# EAGLE design Smarttree_BMS_6 (EAGLE 7.7.0)

## Sheet 1 of 2
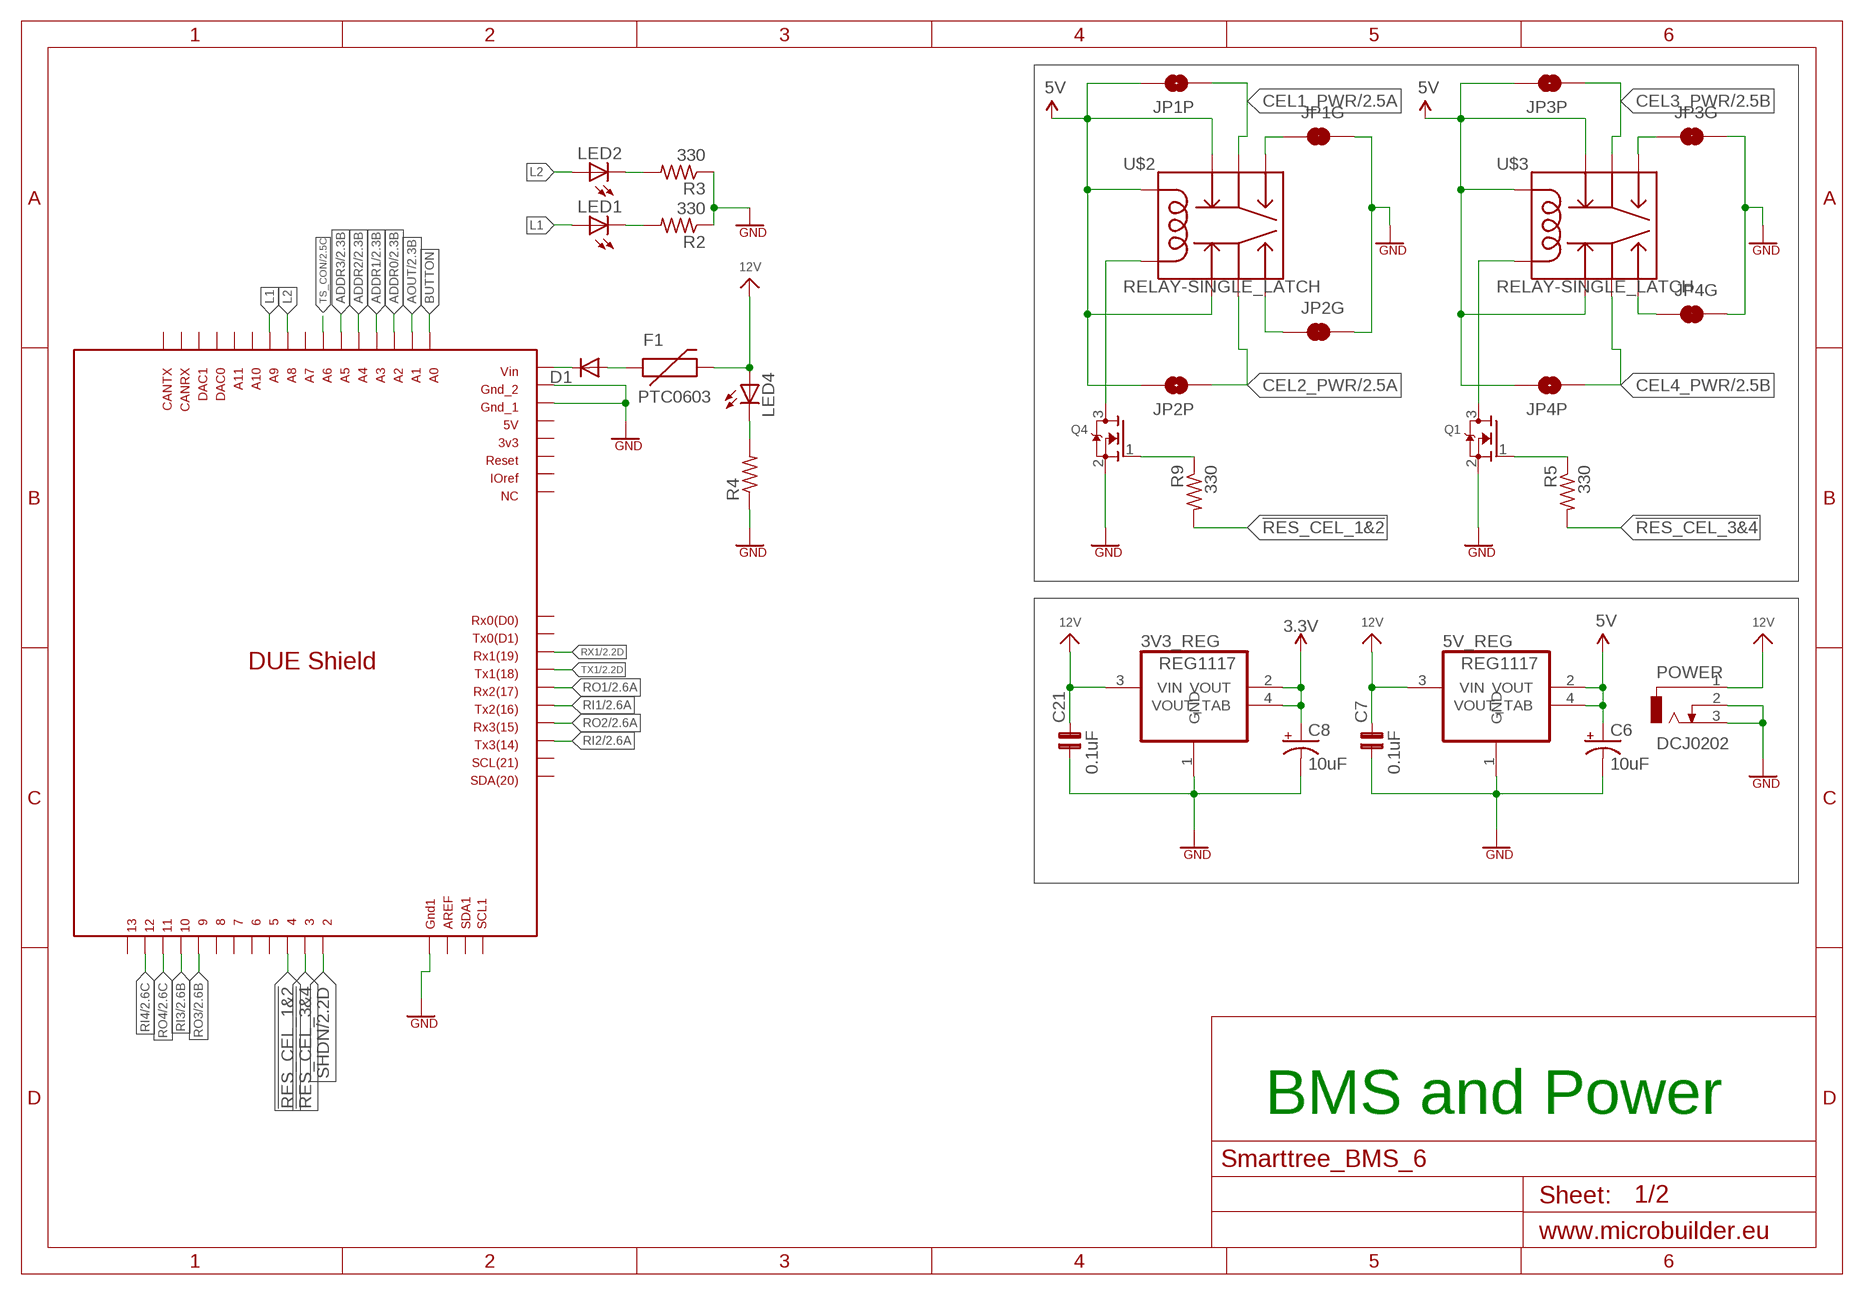
[diagram p0: schematic, sheet 1]

### Parts
3V3_REG  REG1117  [SOT223]
5V_REG  REG1117  [SOT223]
C6  10uF  10UF-TANT  [EIA3216]
C7  0.1uF  C-NP-SMD-0805  [C-0805]
C8  10uF  10UF-TANT  [EIA3216]
C21  0.1uF  C-NP-SMD-0805  [C-0805]
D1  DIODE-SOD106-R  [SOD106-R]
F1  PTC0603  [0603]
JP1G  JUMPER-SMT_2_NC_TRACE_SILK  [SMT-JUMPER_2_NC_TRACE_SILK]
JP1P  JUMPER-SMT_2_NO_SILK  [SMT-JUMPER_2_NO_SILK]
JP2G  JUMPER-SMT_2_NC_TRACE_SILK  [SMT-JUMPER_2_NC_TRACE_SILK]
JP2P  JUMPER-SMT_2_NO_SILK  [SMT-JUMPER_2_NO_SILK]
JP3G  JUMPER-SMT_2_NC_TRACE_SILK  [SMT-JUMPER_2_NC_TRACE_SILK]
JP3P  JUMPER-SMT_2_NO_SILK  [SMT-JUMPER_2_NO_SILK]
JP4G  JUMPER-SMT_2_NC_TRACE_SILK  [SMT-JUMPER_2_NC_TRACE_SILK]
JP4P  JUMPER-SMT_2_NO_SILK  [SMT-JUMPER_2_NO_SILK]
LED1  LED-YELLOW0603  [LED-0603]
LED2  LED-YELLOW0603  [LED-0603]
LED4  LED-YELLOW0603  [LED-0603]
POWER  DCJ0202  [DCJ0202]
Q1  MOSFET-NREFLOW  [SOT23]
Q4  MOSFET-NREFLOW  [SOT23]
R2  330  R-US_M0805  [M0805]
R3  330  R-US_M0805  [M0805]
R4  R-US_M0805  [M0805]
R5  330  R-US_R0805  [R0805]
R9  330  R-US_R0805  [R0805]
U$1  DUE(OUTLINE)  [DUE(NORMAL)]
U$2  RELAY-SINGLE_LATCH  [RELAY-EE2]
U$3  RELAY-SINGLE_LATCH  [RELAY-EE2]

### Nets
3.3V [power]: 3V3_REG.2(VOUT) 3V3_REG.4(VOUT_TAB) C8.A(+) ; also sheet 2
5V [power]: 5V_REG.2(VOUT) 5V_REG.4(VOUT_TAB) C6.A(+) JP1P.2 JP2P.2 JP3P.2 JP4P.2 U$2.P$1(COIL1) U$2.P$3 U$2.P$10 U$3.P$1(COIL1) U$3.P$3 U$3.P$10 ; also sheet 2
12V [power]: 3V3_REG.3(VIN) 5V_REG.3(VIN) C7.2 C21.2 F1.2 LED4.A POWER.1 ; also sheet 2
!RES_CEL_1&2: R9.2 U$1.4
!RES_CEL_3&4: R5.2 U$1.3
ADDR0: U$1.A2 ; also sheet 2
ADDR1: U$1.A3 ; also sheet 2
ADDR2: U$1.A4 ; also sheet 2
ADDR3: U$1.A5 ; also sheet 2
AOUT: U$1.A1 ; also sheet 2
BUTTON: U$1.A0
CEL1_PWR [power]: JP1P.1 U$2.P$4 ; also sheet 2
CEL2_PWR [power]: JP2P.1 U$2.P$9 ; also sheet 2
CEL3_PWR [power]: JP3P.1 U$3.P$4 ; also sheet 2
CEL4_PWR [power]: JP4P.1 U$3.P$9 ; also sheet 2
GND [power]: 3V3_REG.1(GND) 5V_REG.1(GND) C6.C(-) C7.1 C8.C(-) C21.1 JP1G.2 JP2G.2 JP3G.2 JP4G.2 POWER.2 POWER.3 Q1.2(S) Q4.2(S) R2.1 R3.1 R4.1 U$1.GND1 U$1.GND_1 U$1.GND_2 ; also sheet 2
L1: LED1.A U$1.A9
L2: LED2.A U$1.A8
N$1 [power]: JP1G.1 U$2.P$5
N$3: Q4.3(D) U$2.P$12(COIL12)
N$6: Q4.1(G) R9.1
N$7: Q1.1(G) R5.1
N$9: Q1.3(D) U$3.P$12(COIL12)
N$10 [power]: JP3G.1 U$3.P$5
N$11 [power]: JP4G.1 U$3.P$8
N$13 [power]: D1.C U$1.VIN
N$21 [power]: JP2G.1 U$2.P$8
N$57: LED1.C R2.2
N$58: LED2.C R3.2
N$59: LED4.C R4.2
N$69 [power]: D1.A F1.1
RI1: U$1.TX2 ; also sheet 2
RI2: U$1.TX3 ; also sheet 2
RI3: U$1.10 ; also sheet 2
RI4: U$1.12 ; also sheet 2
RO1: U$1.RX2 ; also sheet 2
RO2: U$1.RX3 ; also sheet 2
RO3: U$1.9 ; also sheet 2
RO4: U$1.11 ; also sheet 2
RX1: U$1.RX1 ; also sheet 2
SHDN: U$1.2 ; also sheet 2
TS_CON: U$1.A6 ; also sheet 2
TX1: U$1.TX1 ; also sheet 2
Unconnected: U$1.3V3 U$1.5 U$1.5V U$1.6 U$1.7 U$1.8 U$1.13 U$1.A7 U$1.A10 U$1.A11 U$1.AREF U$1.CANRX U$1.CANTX U$1.DAC0 U$1.DAC1 U$1.IOREF U$1.NC U$1.RESET U$1.RX0 U$1.SCL U$1.SCL1 U$1.SDA U$1.SDA1 U$1.TX0

### Notes on the sheet
- BMS and Power

## Sheet 2 of 2
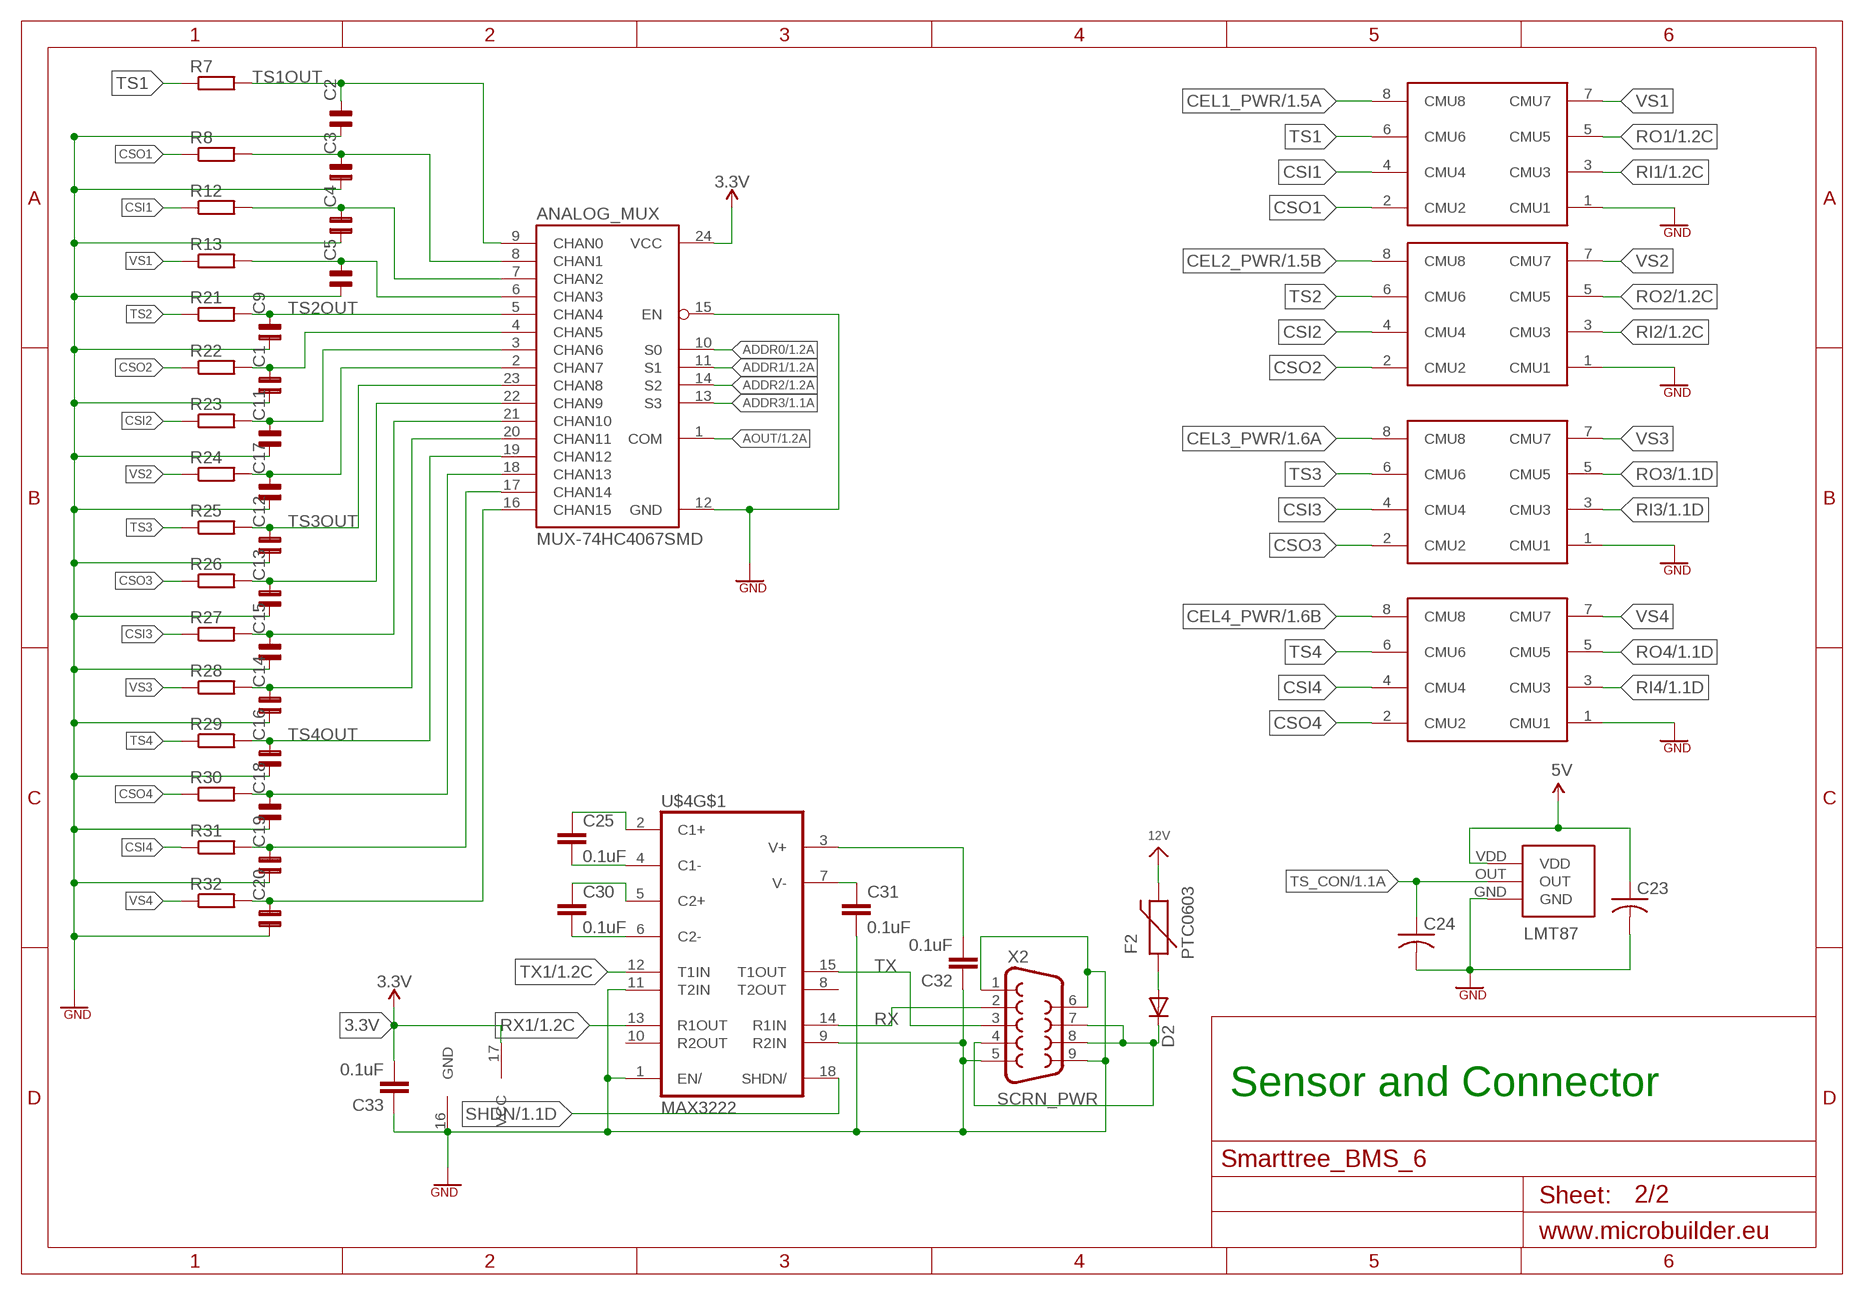
[diagram p1: schematic, sheet 2]

### Parts
ANALOG_MUX  MUX-74HC4067SMD  [SSOP24]
C1  C-NP-SMD-0805  [C-0805]
C2  C-NP-SMD-0805  [C-0805]
C3  C-NP-SMD-0805  [C-0805]
C4  C-NP-SMD-0805  [C-0805]
C5  C-NP-SMD-0805  [C-0805]
C9  C-NP-SMD-0805  [C-0805]
C11  C-NP-SMD-0805  [C-0805]
C12  C-NP-SMD-0805  [C-0805]
C13  C-NP-SMD-0805  [C-0805]
C14  C-NP-SMD-0805  [C-0805]
C15  C-NP-SMD-0805  [C-0805]
C16  C-NP-SMD-0805  [C-0805]
C17  C-NP-SMD-0805  [C-0805]
C18  C-NP-SMD-0805  [C-0805]
C19  C-NP-SMD-0805  [C-0805]
C20  C-NP-SMD-0805  [C-0805]
C23  C-USC0805  [C0805]
C24  C-USC0805  [C0805]
C25  0.1uF  CAP0603-CAP  [0603-CAP]
C30  0.1uF  CAP0603-CAP  [0603-CAP]
C31  0.1uF  CAP0603-CAP  [0603-CAP]
C32  0.1uF  CAP0603-CAP  [0603-CAP]
C33  0.1uF  CAP0603-CAP  [0603-CAP]
CEL1  8PINCONN  [8PINCONN]
CEL2  8PINCONN  [8PINCONN]
CEL3  8PINCONN  [8PINCONN]
CEL4  8PINCONN  [8PINCONN]
D2  DIODE-SOD106-R  [SOD106-R]
F2  PTC0603  [0603]
LMT87  LMT87_PAC  [LMT87_TO]
R7  R-EU_R0805W  [R0805W]
R8  R-EU_R0805W  [R0805W]
R12  R-EU_R0805W  [R0805W]
R13  R-EU_R0805W  [R0805W]
R21  R-EU_R0805W  [R0805W]
R22  R-EU_R0805W  [R0805W]
R23  R-EU_R0805W  [R0805W]
R24  R-EU_R0805W  [R0805W]
R25  R-EU_R0805W  [R0805W]
R26  R-EU_R0805W  [R0805W]
R27  R-EU_R0805W  [R0805W]
R28  R-EU_R0805W  [R0805W]
R29  R-EU_R0805W  [R0805W]
R30  R-EU_R0805W  [R0805W]
R31  R-EU_R0805W  [R0805W]
R32  R-EU_R0805W  [R0805W]
U$4  MAX3222  [SO18]
X2  DB9MALE  [DB9_MALE]

### Nets
3.3V [power]: ANALOG_MUX.24(VCC) C33.2 U$4.17(VCC) ; also sheet 1
5V [power]: C23.1 LMT87.VDD ; also sheet 1
12V [power]: F2.2 ; also sheet 1
ADDR0: ANALOG_MUX.10(S0) ; also sheet 1
ADDR1: ANALOG_MUX.11(S1) ; also sheet 1
ADDR2: ANALOG_MUX.14(S2) ; also sheet 1
ADDR3: ANALOG_MUX.13(S3) ; also sheet 1
AOUT: ANALOG_MUX.1(COM) ; also sheet 1
CEL1_PWR [power]: CEL1.8(CMU8) ; also sheet 1
CEL2_PWR [power]: CEL2.8(CMU8) ; also sheet 1
CEL3_PWR [power]: CEL3.8(CMU8) ; also sheet 1
CEL4_PWR [power]: CEL4.8(CMU8) ; also sheet 1
CSI1: CEL1.4(CMU4) R12.1
CSI2: CEL2.4(CMU4) R23.1
CSI3: CEL3.4(CMU4) R27.1
CSI4: CEL4.4(CMU4) R31.1
CSO1: CEL1.2(CMU2) R8.1
CSO2: CEL2.2(CMU2) R22.1
CSO3: CEL3.2(CMU2) R26.1
CSO4: CEL4.2(CMU2) R30.1
GND [power]: ANALOG_MUX.12(GND) ANALOG_MUX.15(EN) C1.1 C2.1 C3.1 C4.1 C5.1 C9.1 C11.1 C12.1 C13.1 C14.1 C15.1 C16.1 C17.1 C18.1 C19.1 C20.1 C23.2 C24.2 C31.2 C32.1 C33.1 CEL1.1(CMU1) CEL2.1(CMU1) CEL3.1(CMU1) CEL4.1(CMU1) LMT87.GND U$4.1(EN/) U$4.9(R2IN) U$4.11(T2IN) U$4.16(GND) X2.1 X2.5 X2.6 X2.9 ; also sheet 1
N$2: C31.1 U$4.7(V-)
N$5 [power]: D2.A F2.1
N$8: C25.1 U$4.2(C1+)
N$14: C25.2 U$4.4(C1-)
N$15: C30.1 U$4.5(C2+)
N$16: C30.2 U$4.6(C2-)
N$17: ANALOG_MUX.6(CHAN3) C5.2 R13.2
N$18: C32.2 U$4.3(V+)
N$19: ANALOG_MUX.8(CHAN1) C3.2 R8.2
N$20: ANALOG_MUX.7(CHAN2) C4.2 R12.2
N$26: ANALOG_MUX.4(CHAN5) C1.2 R22.2
N$28: ANALOG_MUX.3(CHAN6) C11.2 R23.2
N$30: ANALOG_MUX.2(CHAN7) C17.2 R24.2
N$34: ANALOG_MUX.22(CHAN9) C13.2 R26.2
N$36: ANALOG_MUX.21(CHAN10) C15.2 R27.2
N$38: ANALOG_MUX.20(CHAN11) C14.2 R28.2
N$42: ANALOG_MUX.18(CHAN13) C18.2 R30.2
N$43: ANALOG_MUX.17(CHAN14) C19.2 R31.2
N$46: ANALOG_MUX.16(CHAN15) C20.2 R32.2
RI1: CEL1.3(CMU3) ; also sheet 1
RI2: CEL2.3(CMU3) ; also sheet 1
RI3: CEL3.3(CMU3) ; also sheet 1
RI4: CEL4.3(CMU3) ; also sheet 1
RO1: CEL1.5(CMU5) ; also sheet 1
RO2: CEL2.5(CMU5) ; also sheet 1
RO3: CEL3.5(CMU5) ; also sheet 1
RO4: CEL4.5(CMU5) ; also sheet 1
RX [power]: U$4.14(R1IN) X2.2
RX1: U$4.13(R1OUT) ; also sheet 1
SCRN_PWR [power]: D2.C X2.4 X2.7 X2.8
SHDN: U$4.18(SHDN/) ; also sheet 1
TS1: CEL1.6(CMU6) R7.1
TS1OUT: ANALOG_MUX.9(CHAN0) C2.2 R7.2
TS2: CEL2.6(CMU6) R21.1
TS2OUT: ANALOG_MUX.5(CHAN4) C9.2 R21.2
TS3: CEL3.6(CMU6) R25.1
TS3OUT: ANALOG_MUX.23(CHAN8) C12.2 R25.2
TS4: CEL4.6(CMU6) R29.1
TS4OUT: ANALOG_MUX.19(CHAN12) C16.2 R29.2
TS_CON: C24.1 LMT87.OUT ; also sheet 1
TX: U$4.15(T1OUT) X2.3
TX1: U$4.12(T1IN) ; also sheet 1
VS1: CEL1.7(CMU7) R13.1
VS2: CEL2.7(CMU7) R24.1
VS3: CEL3.7(CMU7) R28.1
VS4: CEL4.7(CMU7) R32.1
Unconnected: U$4.8(T2OUT) U$4.10(R2OUT)

### Notes on the sheet
- Sensor and Connector

## Library data of the parts
3V3_REG 5V_REG = burr-brown:REG1117: 800mA and 1A Low Dropout (LDO) Positive Regulator 1.8V, 2.5V, 2.85V, 3.3V, 5V, and Adj; MPN: REG1117; OC_FARNELL: 1097566; OC_NEWARK: 14P6981
ANALOG_MUX = SparkFun-AnalogIC:MUX-74HC4067: 16-channel analog MUX; OC_NEWARK: unknown
C1-C5 C7 C9 C11-C21 = cap-pan40:C-NP: NON-POLARIZED FILM/CHIP; OC_NEWARK: unknown
C6 C8 = SparkFun-Retired:10UF-TANT: 10uF Tantalum SMT CAP-00811- 16V 10% (EIA-3216); OC_NEWARK: unknown; PROD_ID: CAP-00811
C23 C24 = adafruit:C-US: CAPACITOR, American symbol
C25 C30-C33 = SparkFun:CAP: Capacitor Standard 0603 ceramic capacitor, and 0.1" leaded capacitor.
CEL1-CEL4 = SmartTreeCan:8PINCONN
D1 D2 = diode:DIODE-: DIODE; OC_NEWARK: unknown
F1 F2 = SparkFun:PTC: Resettable Fuse PTC Resettable Fuse. Spark Fun Electronics SKU : COM-08357
JP1G JP2G JP3G JP4G = SparkFun-Jumpers:JUMPER-SMT_2_NC_TRACE: Normally closed trace jumper This jumper has a trace between two pads so it's normally closed (NC). Use a razor knife to open the connection. For best results follow the IPC guidelines for cutting traces: Cutout at least 0.063 mm (0.005 in). Remove all loose material to clean up the cut area. Seal the cut with an approved epoxy. Reapply solder to reclose the connection.
JP1P JP2P JP3P JP4P = SparkFun-Jumpers:JUMPER-SMT_2_NO: Normally open jumper This jumper has two pads in close proximity to each other. Apply solder to close the connection. Round pads are easier to solder for beginners, but are a lot larger. SparkFun Product that uses the round pads: SparkFun EL Sequencer <https://www.sparkfun.com/products/12781>
LED1 LED2 LED4 = SparkFun-LED:LED-YELLOW: Yellow SMD LEDs LilyPad 1206- DIO-09909 0603- DIO-09003; PROD_ID: DIO-09003
LMT87 = nick:LMT87_PAC
POWER = con-jack:DCJ0202: DC POWER JACK Source: DCJ0202.pdf; OC_FARNELL: unknown; OC_NEWARK: unknown
Q1 Q4 = adafruit:MOSFET-N: N-Channel Mosfet 2N7002E - 60V 260mA SOT23 [Digikey: 2N7002ET1GOSTR-ND] - REEL BSH103 - 30V 850mA SOT23 [Digikey: 568-5013-1-ND]
R2-R4 = adafruit:R-US_: RESISTOR, American symbol; OC_NEWARK: unknown
R5 R9 = adafruit:R-US_: RESISTOR, American symbol
R7 R8 R12 R13 R21-R32 = resistor:R-EU_: RESISTOR, European symbol; OC_NEWARK: unknown
U$1 = DUElib130425:DUE(OUTLINE)
U$2 U$3 = SmartTreeCan:RELAY-SINGLE_LATCH
U$4 = Francis-Project:MAX3222
X2 = SparkFun-Connectors:DB9: DB9 Connector Standard DB9 (D-Sub 9) serial connector. Can be used for CAN bus as well as RS485 and RS232. Footprint production proven. Spark Fun Electronics SKU : PRT-00429; PROD_ID: CONN-09904

## Net classes
0 default: width 0.203 mm
1 power: width 0.33 mm, clearance 0.152 mm

## Board
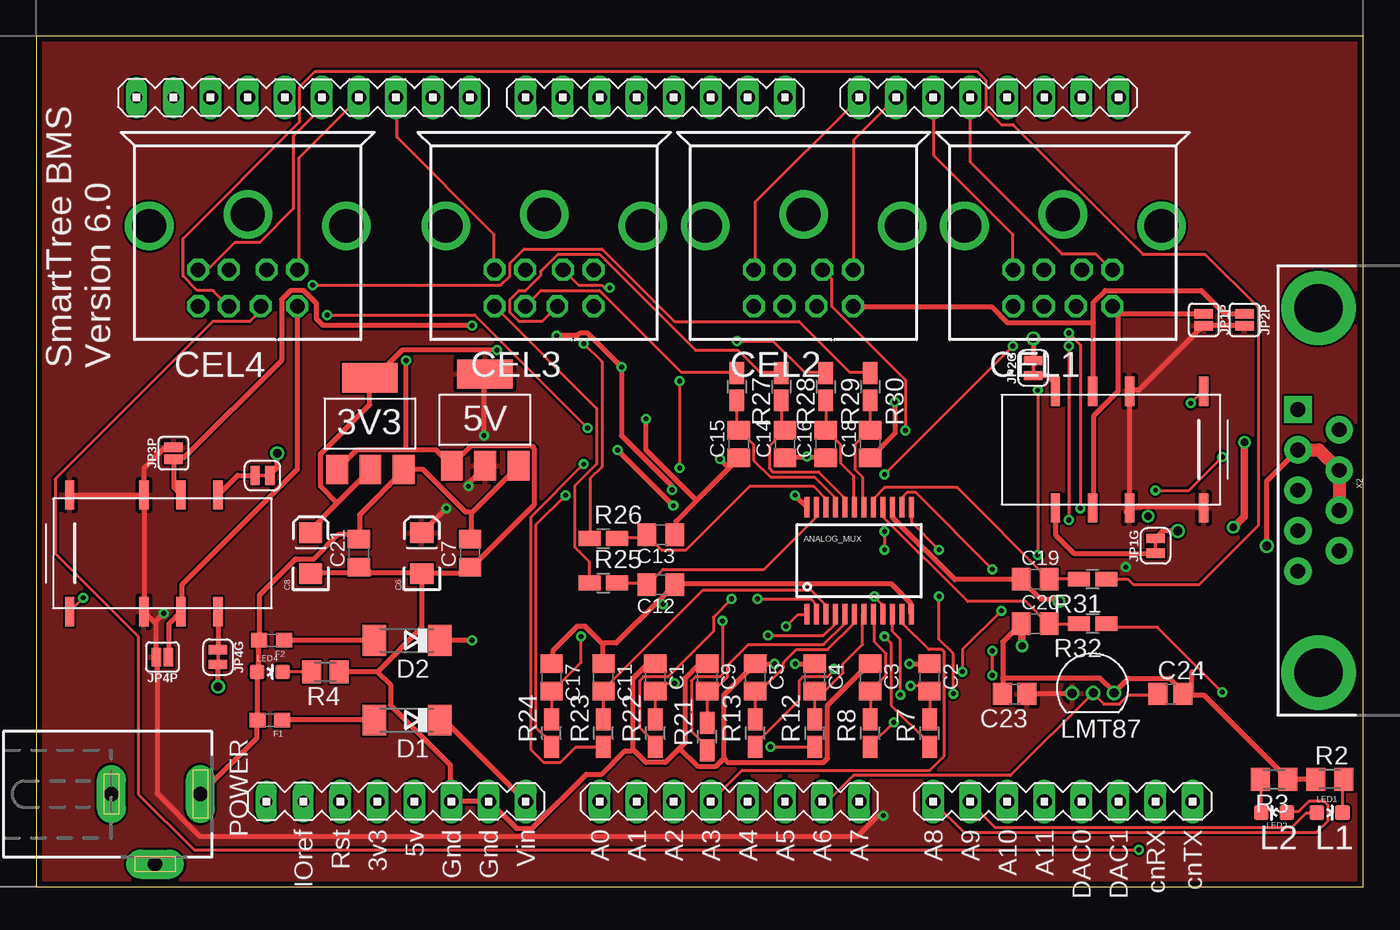
[diagram p2: board, top side]
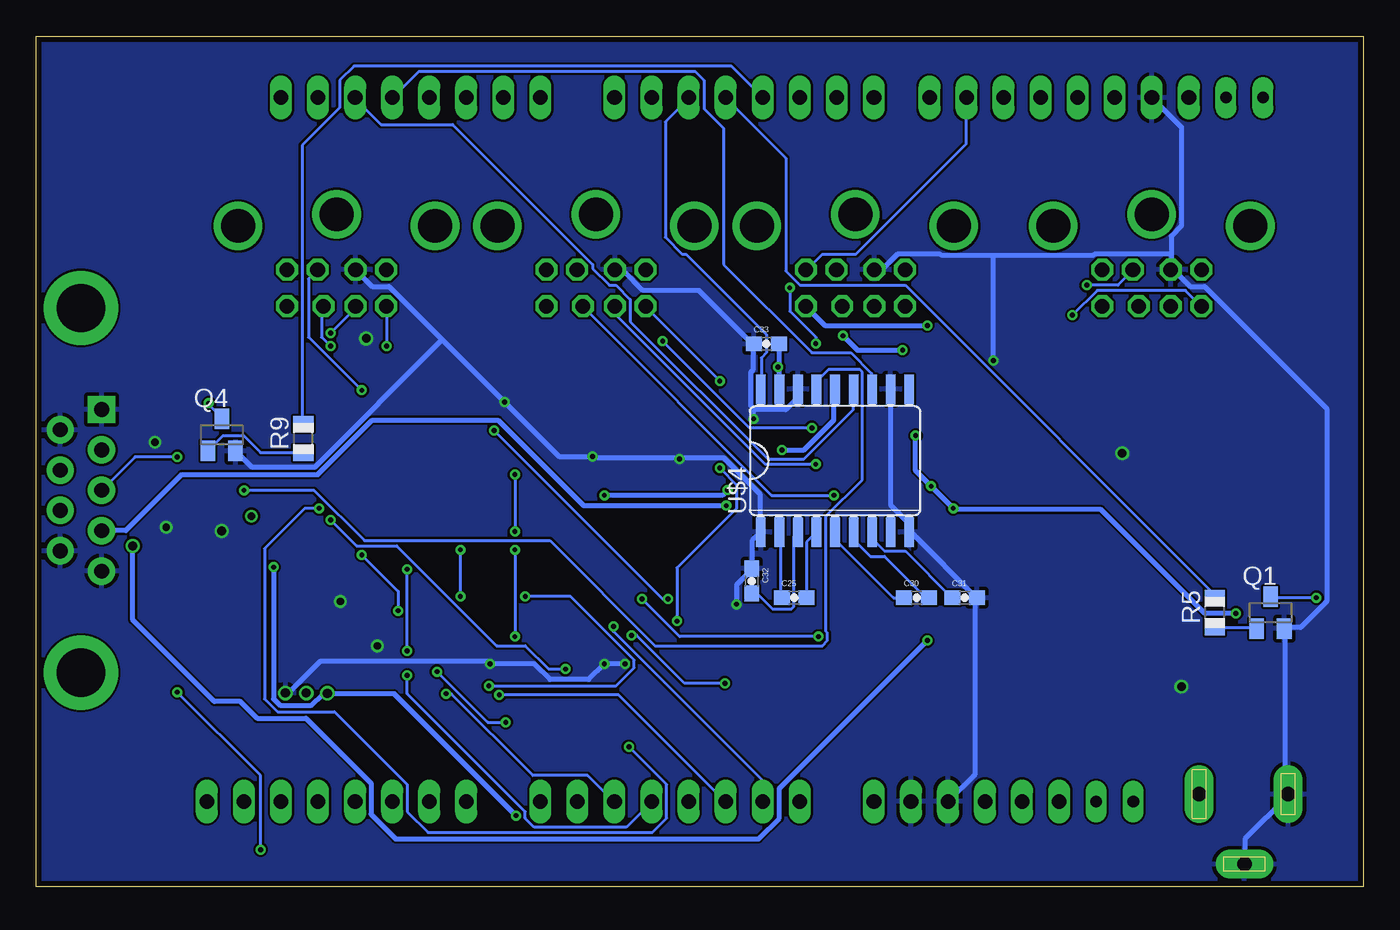
[diagram p3: board, bottom side, seen from below]

Size 90.93 x 58.29 mm. Coordinates in mm from the lower left corner, seen from the top.
Outline: 0,0 90.93,0 90.93,58.29 0,58.29 0,0
Copper layers (1*16): Top 0.0356mm / dielectric 1.5011mm / Bottom 0.0356mm
Design rules "LaenPCBOrder *": minimum track width 6mil, minimum drill 13mil, track to track 6mil, track to pad 6mil, pad to pad 6mil, via to via 6mil, smd to smd 6mil, copper to edge 15mil, drill to drill 8mil, minimum pad ring 7mil, minimum via ring 7mil, stop-mask expansion 3mil, vias tented up to drill 0mil, thermal gap 10mil

### Footprints (pad centres in the part's own frame; a part is rotated, then mirrored left to right if it is on the bottom)
SOT223 = smd 1.499 x 2.007: 1 -2.261,-3.15; 2 0.025,-3.15; 3 2.311,-3.15 | smd 3.81 x 2.007: 4 0,3.15
SSOP24 = smd 0.348 x 1.397: 1 -3.575,-3.656; 2 -2.925,-3.656; 3 -2.275,-3.656; 4 -1.625,-3.656; 5 -0.975,-3.656; 6 -0.325,-3.656; 7 0.325,-3.656; 8 0.975,-3.656; 9 1.625,-3.656; 10 2.275,-3.656; 11 2.925,-3.656; 12 3.575,-3.656; 13 3.575,3.656; 14 2.925,3.656; 15 2.275,3.656; 16 1.625,3.656; 17 0.975,3.656; 18 0.325,3.656; 19 -0.325,3.656; 20 -0.975,3.656; 21 -1.625,3.656; 22 -2.275,3.656; 23 -2.925,3.656; 24 -3.575,3.656
C-0805 = smd 1.27 x 1.524: 1 -0.953,0; 2 0.953,0
EIA3216 = smd 1.4 x 1.6: A 1.4,0; C -1.4,0
C0805 = smd 1.3 x 1.5: 1 -0.85,0; 2 0.85,0
0603-CAP = smd 1.1 x 1: 1 -0.85,0; 2 0.85,0
8PINCONN = drill 1 octagon: 1 -1.3,-8.5; 2 1.3,-8.5; 3 -3.4,-8.5; 4 -1.3,-11; 5 3.4,-8.5; 6 -3.4,-11; 7 0.9,-11; 8 3.4,-11 | drill 2.31: P$1 -6.75,-5.5; P$2 6.75,-5.5; P$3 0,-4.7
SOD106-R = smd 1.6 x 2.1: A 2.25,0; C -2.25,0
0603 = smd 1.1 x 1: 1 -0.85,0; 2 0.85,0
SMT-JUMPER_2_NC_TRACE_SILK = smd 0.635 x 1.27: 1 -0.508,0; 2 0.508,0
SMT-JUMPER_2_NO_SILK = smd 0.635 x 1.27: 1 -0.406,0; 2 0.406,0
LED-0603 = smd 1 x 1: A 0,-0.877; C 0,0.877
LMT87_TO = drill 0.635: GND 0.305,-1.346; OUT 1.727,-1.346; VDD 3.175,-1.321
DCJ0202 = drill 1 pad 2 long: 1 0,3.1; 2 4.8,0; 3 0,-3
SOT23 = smd 1 x 1.4: 1 -0.95,-1.1; 2 0.95,-1.1; 3 0,1.1
M0805 = smd 1.3 x 1.6: 1 -0.95,0; 2 0.95,0
R0805 = smd 1.1 x 1.4: 1 -1,0; 2 1,0
R0805W = smd 1.5 x 1: 1 -0.94,0; 2 0.94,0
DUE(NORMAL) = drill 1 long: 2 -16.51,30.48; 3 -19.05,30.48; 3V3 -39.37,-17.78; 4 -21.59,30.48; 5 -24.13,30.48; 5V -36.83,-17.78; 6 -26.67,30.48; 7 -29.21,30.48; 8 -33.02,30.48; 9 -35.56,30.48; 10 -38.1,30.48; 11 -40.64,30.48; 12 -43.18,30.48; 13 -45.72,30.48; A0 -24.13,-17.78; A1 -21.59,-17.78; A2 -19.05,-17.78; A3 -16.51,-17.78; A4 -13.97,-17.78; A5 -11.43,-17.78; A6 -8.89,-17.78; A7 -6.35,-17.78; A8 -1.27,-17.78; A9 1.27,-17.78; A10 3.81,-17.78; A11 6.35,-17.78; AREF -50.8,30.48; AREF1 -50.8,30.48; CANRX 13.97,-17.78; CANTX 16.51,-17.78; DAC0 8.89,-17.78; DAC1 11.43,-17.78; GND1 -48.26,30.48; GND_1 -34.29,-17.78; GND_2 -31.75,-17.78; RESET -41.91,-17.78; RX0 -11.43,30.48; RX1 6.35,30.48; RX2 1.27,30.48; RX3 -3.81,30.48; SCL 11.43,30.48; SDA 8.89,30.48; TX0 -13.97,30.48; TX1 3.81,30.48; TX2 -1.27,30.48; TX3 -6.35,30.48; VIN -29.21,-17.78 | drill 0.8 pad 1.422 long: IOREF -44.45,-17.78; NC -46.99,-17.78; SCL1 -55.88,30.48; SDA1 -53.34,30.48
RELAY-EE2 = smd 0.635 x 2: P$1 -6.35,4; P$3 -1.27,4; P$4 1.27,4; P$5 3.81,4; P$8 3.81,-4; P$9 1.27,-4; P$10 -1.27,-4; P$12 -6.35,-4
SO18 = smd 0.66 x 2.032: 1 -5.08,-4.902; 2 -3.81,-4.902; 3 -2.54,-4.902; 4 -1.27,-4.902; 5 0,-4.902; 6 1.27,-4.902; 7 2.54,-4.902; 8 3.81,-4.902; 9 5.08,-4.902; 10 5.08,4.902; 11 3.81,4.902; 12 2.54,4.902; 13 1.27,4.902; 14 0,4.902; 15 -1.27,4.902; 16 -2.54,4.902; 17 -3.81,4.902; 18 -5.08,4.902
DB9_MALE = drill 1.016 pad 1.88: 1 5.54,-1.42; 2 2.77,-1.42; 3 0,-1.42; 4 -2.77,-1.42; 6 4.15,1.42; 7 1.38,1.42; 8 -1.38,1.42; 9 -4.15,1.42 | drill 1.016 pad 1.88 square: 5 -5.54,-1.42 | drill 3.302 pad 5.08: G1 -12.5,0; G2 12.5,0

### Placement (x,y rotation side)
3V3_REG  22.86,31.75 0 top
5V_REG  30.73,32 0 top
ANALOG_MUX  56.39,22.35 0 top
C1  42.42,14.35 270 top
C2  61.21,14.35 270 top
C3  57.15,14.35 270 top
C4  53.34,14.35 270 top
C5  49.28,14.35 270 top
C6  26.42,22.86 90 top
C7  29.72,22.86 90 top
C8  18.8,22.86 90 top
C9  45.97,14.35 270 top
C11  38.86,14.35 270 top
C12  42.8,20.7 180 top
C13  42.8,24.13 180 top
C14  51.31,30.35 90 top
C15  48.13,30.35 90 top
C16  54.1,30.35 90 top
C17  35.31,14.35 270 top
C18  57.15,30.35 90 top
C19  68.45,21.08 0 top
C20  68.45,18.03 0 top
C21  22.1,22.86 90 top
C23  67.06,13.21 180 top
C24  77.72,13.21 0 top
C25  38.99,19.81 0 bottom
C30  30.61,19.81 0 bottom
C31  27.3,19.81 0 bottom
C32  41.91,20.95 270 bottom
C33  40.89,37.21 0 bottom
CEL1  70.36,50.8 0 top
CEL2  52.58,50.8 0 top
CEL3  34.8,50.8 0 top
CEL4  14.48,50.8 0 top
D1  25.4,11.43 180 top
D2  25.4,16.89 180 top
F1  16,11.43 180 top
F2  16.13,16.89 180 top
JP1G  76.71,23.37 90 top
JP1P  80.01,38.86 270 top
JP2G  68.33,35.56 90 top
JP2P  82.8,38.86 270 top
JP3G  15.49,28.19 0 top
JP3P  9.4,29.72 90 top
JP4G  12.45,15.75 270 top
JP4P  8.64,15.75 180 top
LED1  88.65,5.08 270 top
LED2  84.84,5.08 90 top
LED4  16,14.73 270 top
LMT87  74.17,11.94 180 top
POWER  8.13,6.35 270 top
Q1  6.35,18.8 0 bottom
Q4  78.23,30.99 0 bottom
R2  88.65,7.37 0 top
R3  84.84,7.37 180 top
R4  19.81,14.73 180 top
R5  10.16,18.8 90 bottom
R7  61.21,10.54 90 top
R8  57.15,10.54 90 top
R9  72.64,30.73 90 bottom
R12  53.34,10.54 90 top
R13  49.28,10.54 90 top
R21  45.97,10.29 90 top
R22  42.42,10.54 90 top
R23  38.86,10.54 90 top
R24  35.31,10.54 90 top
R25  38.86,20.83 0 top
R26  38.86,23.88 0 top
R27  48.01,34.29 270 top
R28  51.05,34.29 270 top
R29  54.1,34.29 270 top
R30  57.15,34.29 270 top
R31  72.39,21.08 180 top
R32  72.39,18.03 180 top
U$1  62.74,23.62 0 top
U$2  73.66,29.97 180 top
U$3  8.64,22.86 0 top
U$4  36.2,29.21 0 bottom
X2  87.88,27.18 270 top

### Tracks (layer width: path | path; a pad name or v marks a point on that pad's centre or on a via)
3.3V  (via drill 0.33)
  Top 0.33: 20.62,26.3 22.85,28.52 3V3_REG.2 | 20.62,26.3 18.85,24.52 18.85,24.35 C8.A | 20.62,26.3 19.47,27.46 19.47,29.68 22.85,33.06 22.85,34.84 3V3_REG.4 23.02,34.93 23.2,34.93 25.07,36.79 v31.56,36.79 | v52.01,26.84 52.81,26.03 ANALOG_MUX.24 | v43.56,27.19 43.56,27.46 40.09,30.93 v40.09,35.64 37.78,37.95 37.25,37.95 37.07,37.77 v35.65,37.77
  Bottom 0.33: U$4.17 40.01,35.64 | 40.01,35.64 40.01,37.15 C33.2 | v52.01,26.84 43.92,26.84 v43.56,27.19 | v40.09,35.64 40.01,35.64 | v31.56,36.79 34.67,36.79 v35.65,37.77
5V  (via drill 0.33)
  Top 0.33: JP2P.2 82.77,38.48 80.01,38.48 JP1P.2 79.92,38.39 75.56,34.04 74.94,34.04 U$2.P$10 74.94,33.86 74.94,26.12 U$2.P$3 | C23.1 67.92,13.23 70.94,13.23 LMT87.VDD | U$2.P$3 74.94,26.03 80.01,26.03 U$2.P$1 | 74.68,25.68 74.85,25.86 U$2.P$3 | v28.09,25.95 26.49,24.35 C6.A | v29.6,27.46 29.6,27.64 30.76,28.79 5V_REG.2 | v30.67,30.93 30.67,35.1 5V_REG.4 | 8.09,18.12 7.38,18.83 U$3.P$10 7.38,19.01 7.38,26.75 U$3.P$3 | 8.09,18.12 8.18,18.03 8.18,15.81 JP4P.2 8.27,15.63 8.27,6.39 11.2,3.45 56.27,3.45 57.7,4.88 v58.05,4.88 | JP3P.2 8.8,30.12 7.38,28.7 7.38,26.92 U$3.P$3 | U$3.P$1 2.31,26.84 7.2,26.84 U$3.P$3 | 8.09,18.12 v8.71,18.74
  Bottom 0.33: v74.68,21.91 74.68,12.88 74.23,12.43 72.1,12.43 71.3,13.23 71.03,13.23 LMT87.VDD 70.85,13.23 66.41,13.23 v58.05,4.88 | v30.67,30.93 30.67,28.52 v29.6,27.46 v28.09,25.95 28,25.86 17.96,25.86 10.85,18.74 v8.71,18.74
  pour Top: -2.54,-2.54 -2.54,60.96 93.98,60.96 93.98,-2.54
12V
  Top 0.33: 22.14,24.35 22.14,25.5 25.16,28.52 3V3_REG.3 25.34,28.61 26.49,28.61 29.43,25.68 29.69,25.68 29.78,25.59 | 29.78,25.59 29.78,24.35 | 5V_REG.3 29.78,25.59 | POWER.1 11.29,6.39 15.11,10.21 15.11,11.28 F1.2 15.11,11.46 15.11,14.57 LED4.A 15.2,14.74 15.2,16.88 F2.2 15.29,17.06 15.29,19.99 17.78,22.48 19.02,22.48 20.71,24.17 21.96,24.17
  Top 0.406: C7.2 29.78,23.81 29.78,24.35 | C21.2 22.1,24.03 21.96,24.17 22.14,24.35
!RES_CEL_1&2
  Bottom 0.203: R9.2 72.72,31.81 72.72,50.84 70.14,53.42 70.14,55.28 69.16,56.26 43.29,56.26 41.16,54.13 U$1.4
!RES_CEL_3&4
  Bottom 0.203: R5.2 10.22,19.81 10.22,20.08 31.38,41.24 38.58,41.24 39.56,42.22 39.56,49.95 43.65,54.04 U$1.3
ADDR0  (via drill 0.33)
  Top 0.203: v59.21,13.14 59.21,16.97 58.67,17.5 58.67,18.66 ANALOG_MUX.10
  Bottom 0.203: v59.21,13.14 51.03,13.14 43.74,5.86 U$1.A2
ADDR1
  Top 0.203: ANALOG_MUX.11 59.38,18.66 59.38,18.03 61.16,16.26 62.05,16.26 62.23,16.08 62.23,8.97 61.25,7.99 48.36,7.99 46.23,5.86 U$1.A3
ADDR2  (via drill 0.33)
  Top 0.203: v65.52,21.77 60.27,27.01 59.65,27.01 59.38,26.75 59.38,26.03 ANALOG_MUX.14 | v65.52,14.48 v65.52,16.17
  Bottom 0.203: v65.52,16.17 v65.52,21.77 | v65.52,14.48 65.52,13.23 57.43,5.14 57.43,4.7 56.81,4.08 50.49,4.08 48.81,5.77 U$1.A4
ADDR3  (via drill 0.33)
  Top 0.203: v61.87,23.1 60.01,24.97 60.01,25.95 ANALOG_MUX.13 | v61.87,19.9 61.87,16.97 62.85,15.99 v62.85,13.23
  Bottom 0.203: v61.87,19.9 v61.87,23.1 | v62.85,13.23 62.5,13.23 56.9,7.63 53.16,7.63 51.38,5.86 U$1.A5
AOUT  (via drill 0.33)
  Top 0.203: v51.38,17.86 52.18,18.66 52.81,18.66 ANALOG_MUX.1
  Bottom 0.203: v51.38,17.86 51.38,17.5 41.16,7.28 41.16,5.86 U$1.A1
CEL1_PWR
  Top 0.33: JP1P.1 74.23,39.28 73.79,39.73 CEL1.8 74.14,39.19 74.14,33.95 72.45,32.26 72.45,26.03 U$2.P$4
CEL2_PWR
  Top 0.33: 72.45,38.66 72.45,34.04 U$2.P$9 | 72.45,38.66 72.45,40.08 73.25,40.88 79.83,40.88 81.43,39.28 82.77,39.28 JP2P.1 | 72.45,38.66 66.59,38.66 65.52,39.73 56.01,39.73 CEL2.8
CEL3_PWR  (via drill 0.33)
  Top 0.33: U$3.P$4 9.87,26.92 9.42,27.37 9.42,29.23 JP3P.1 9.51,29.41 10.13,29.41 16.8,36.08 16.8,40.26 17.42,40.88 18.31,40.88 19.2,39.99 19.2,38.93 19.65,38.48 v29.87,38.48
  Bottom 0.33: v29.87,38.48 36.89,38.48 38.14,39.73 CEL3.8
CEL4_PWR
  Top 0.33: JP4P.1 9.07,15.81 9.07,18.03 9.87,18.83 U$3.P$9 9.96,19.01 9.96,20.7 17.87,28.61 17.87,39.73 CEL4.8
CSI1  (via drill 0.33)
  Top 0.203: v50.32,9.59 53.34,9.59 R12.1 | v71.56,25.95 71.56,37.15 v70.76,37.95
  Bottom 0.203: v50.32,9.59 47.74,7.01 47.74,4.7 48.72,3.72 64.1,3.72 65.52,5.14 65.52,7.01 70.5,11.99 74.41,11.99 75.3,12.88 75.3,23.19 72.54,25.95 v71.56,25.95 | v70.76,37.95 68.99,39.73 CEL1.4
CSI2  (via drill 0.33)
  Top 0.203: v37.52,28.97 33.87,25.32 33.87,9.41 34.76,8.52 35.92,8.52 36.98,9.59 38.85,9.59 R23.1
  Bottom 0.203: v37.52,28.97 40.98,28.97 51.21,39.19 51.21,39.73 CEL2.4
CSI3
  Top 0.203: R27.1 48.01,35.28 44.18,35.28 38.58,40.88 34.58,40.88 33.52,39.82 CEL3.4
CSI4
  Top 0.203: R31.1 73.34,21.06 74.85,21.06 75.21,20.7 79.68,20.7 83.74,24.77 83.74,39.73 80.1,43.37 75.83,43.37 66.94,52.26 66.14,52.26 65.08,53.33 65.08,55.28 64.45,55.91 19.11,55.91 18.05,54.84 18.05,52.44 10.05,44.44 10.05,41.86 11.02,40.88 12.09,40.88 13.16,39.82 CEL4.4
CSO1  (via drill 0.33)
  Top 0.203: v58.76,11.28 57.16,9.68 R8.1 | v63.48,14.74 63.48,16.26 v66.14,18.92 | v68.63,34.04 v68.63,22.75
  Bottom 0.203: v58.76,11.28 60.01,11.28 v63.48,14.74 | v66.14,18.92 66.14,20.26 v68.63,22.75 | v68.63,34.04 72.28,37.68 72.28,41.68 71.74,42.22 CEL1.2
CSO2  (via drill 0.33)
  Top 0.203: v47.65,19.72 46.41,18.48 46.41,17.5 43.29,14.39 41.6,14.39 41.34,14.12 41.34,10.92 42.41,9.86 42.41,9.68 R22.1 | v59.56,31.28 59.56,34.75 54.5,39.82 54.5,41.68 53.96,42.22 CEL2.2
  Bottom 0.203: v47.65,19.72 48.01,19.72 v59.56,31.28
CSO3  (via drill 0.33)
  Top 0.203: v37.52,37.24 38.76,35.99 38.76,28.79 37.96,27.99 37.96,23.9 R26.1 | v39.29,41.06 38.94,41.06 38.76,41.24 37.16,41.24 36.18,42.22 CEL3.2
  Bottom 0.203: v37.52,37.24 37.52,37.68 39.29,39.46 v39.29,41.06
CSO4  (via drill 0.33)
  Top 0.203: v18.94,41.24 31.83,41.24 32.45,41.86 32.45,42.75 33.43,43.73 38.76,43.73 43.74,38.75 52.27,38.75 55.74,35.28 57.07,35.28 R30.1
  Bottom 0.203: v18.94,41.24 16.8,41.24 15.82,42.22 CEL4.2
GND  (via drill 0.33, 0.51, 0.6)
  Top 0.33: 38.85,16.61 37.6,17.86 37.07,17.86 35.38,16.17 35.38,15.37 C17.1 | 38.85,16.61 38.85,15.37 C11.1 | ANALOG_MUX.12 59.92,18.74 59.92,19.46 58.59,20.79 43.92,20.79 43.83,20.7 C12.1 43.65,20.61 42.67,19.63 | 42.67,19.63 39.74,16.7 38.94,16.7 38.85,16.61 | 45.25,26.48 48.09,29.32 C15.1 47.38,28.79 v46.85,29.32 | 45.25,26.48 43.83,25.06 43.83,24.17 C13.1 | 52.81,29.41 54.05,29.41 C16.1 | 52.81,29.41 51.38,29.41 C14.1 | C18.1 58.85,31.1 v58.85,33.24 | v52.81,29.5 52.81,29.41 | v41.78,32.08 41.78,29.95 45.25,26.48 | v42.94,19.37 42.67,19.63 | ANALOG_MUX.15 58.67,25.95 58.67,25.32 62.94,21.06 67.47,21.06 C19.1 67.56,20.97 68.83,19.7 69.96,19.7 v70.1,19.56 | 66.23,14.3 66.23,16.79 67.47,18.03 C20.1 | 66.23,14.3 66.23,13.23 C23.2 | R2.1 R3.1 85.7,7.46 80.01,13.14 78.68,13.14 C24.2 | C24.2 78.5,13.23 78.5,13.5 77.7,14.3 74.85,14.3 73.88,13.32 LMT87.GND 73.79,13.41 72.9,14.3 66.23,14.3 | 79.21,14.74 79.21,13.23 C24.2 | 40.89,9.41 40.89,14.3 41.87,15.28 42.41,15.28 C1.1 | 40.89,9.41 41.78,8.52 43.12,8.52 44.09,9.5 | 44.09,9.5 44.45,9.86 44.45,14.3 45.43,15.28 45.96,15.28 C9.1 | 47.12,8.79 47.12,13.14 C5.1 49.43,15.28 v50.58,15.28 | 47.12,8.79 46.58,8.26 45.34,8.26 44.09,9.5 | v52.01,15.28 53.34,15.28 C4.1 | 47.12,8.79 47.38,8.52 53.96,8.52 54.23,8.79 54.23,12.43 57.07,15.28 C3.1 | v59.83,15.28 61.16,15.28 C2.1 | 25.34,29.95 27.38,29.95 5V_REG.1 28.54,28.97 29.78,30.21 33.96,30.21 34.14,30.04 34.14,26.21 29.78,21.86 29.78,21.59 | 25.34,29.95 21.96,29.95 20.62,28.61 3V3_REG.1 | 22.05,21.5 18.85,21.5 C8.C | 23.38,14.74 20.8,14.74 R4.1 | 23.38,14.74 26.4,17.77 26.4,21.41 C6.C | 29.69,21.5 26.58,21.5 C6.C
  Top 0.33: 22.23,21.5 22.86,21.5 26.31,21.5 C6.C | 23.38,14.74 24.27,13.86 24.27,12.43 28.36,8.34 28.36,5.94 U$1.GND_1 28.45,5.86 30.94,5.86 U$1.GND_2 31.11,5.77 32.89,3.99 33.96,3.99 37.69,7.72 38.76,7.72 40.36,9.32 40.8,9.32 40.89,9.41 | 25.34,29.95 v25.34,36.08 | v12.45,13.72 JP4G.2 | JP3G.2 16.51,28.7 v16.51,29.72 | v78.23,24.38 77.22,24.38 JP1G.2 | v68.33,37.59 JP2G.2
  Top 0.406: 29.78,21.86 29.77,21.86 C7.1 | C21.1 22.45,21.91 22.86,21.5 | 22.23,21.5 22.05,21.5
  Top 0.508: v82.04,24.64 82.8,25.4 v82.8,30.48 | C20.1 67.56,17.97 v67.56,16.51
  Bottom 0.33: POWER.2 8.09,1.59 8.09,3.28 5.16,6.21 POWER.3 5.16,6.39 5.33,6.57 5.33,17.68 Q1.2 5.25,17.77 4.27,17.77 2.49,19.55 2.49,32.79 10.85,41.15 11.82,41.15 13.07,42.39 CEL4.1 13.16,42.3 13.16,43.37 | 13.16,43.37 13.16,44.62 12.45,45.33 12.45,52.08 14.4,54.04 U$1.GND1 | 25.34,43.28 18.49,43.28 18.4,43.37 13.16,43.37 | 25.34,43.28 28.89,43.28 28.98,43.37 31.91,43.37 32.98,42.3 33.43,42.3 CEL3.1 | 41.69,32.7 41.96,32.97 41.96,35.28 41.78,35.46 41.78,37.15 C33.1 41.87,37.24 45.52,40.88 49.34,40.88 50.67,42.22 51.21,42.22 CEL2.1 | 41.69,32.7 39.56,32.7 38.76,33.5 38.76,34.04 U$4.16 | 63.12,37.5 66.76,41.15 67.92,41.15 68.99,42.22 CEL1.1 | 63.12,37.5 v58.85,33.24 55.12,29.5 v52.81,29.5 52.72,29.41 46.85,29.41 | 46.85,29.41 43.83,29.41 41.34,26.92 41.34,24.44 U$4.1 41.34,24.26 41.87,23.72 41.87,21.86 C32.1 41.96,21.68 42.94,20.7 v42.94,19.37 | v46.85,29.32 46.85,29.41 | v41.78,32.08 41.78,32.61 41.69,32.7 | 77.52,29.86 77.34,29.86 Q4.2 77.17,29.77 76.19,28.79 71.83,28.79 63.12,37.5 | v50.58,15.28 v52.01,15.28 53.07,14.21 55.74,14.21 56.81,15.28 v59.83,15.28 60.01,15.46 71.48,15.46 73.61,13.32 73.79,13.32 LMT87.GND | U$4.11 32.36,34.04 32.36,26.12 31.2,24.97 31.2,24.44 U$4.9 31.11,24.26 30.94,24.26 26.49,19.81 C31.2 26.58,19.72 26.58,7.72 28.45,5.86 U$1.GND_1 | v25.34,36.08 25.34,43.28
  pour Bottom: -5.08,0 -5.08,63.5 96.52,63.5 96.52,0
L1
  Top 0.203: LED1.A 87.74,5.05 87.03,5.05 86.06,4.08 65.7,4.08 64.01,5.77 U$1.A9
L2
  Top 0.203: LED2.A 85.79,5.14 86.5,5.14 87.21,5.86 88.28,5.86 88.54,5.59 88.54,4.52 87.74,3.72 63.56,3.72 61.52,5.77 U$1.A8
N$1
  Top 0.33: U$2.P$5 69.85,24.13 71.12,22.86 JP1G.1
N$2
  Bottom 0.203: C31.1 28.18,19.81 31.38,23.01 32.8,23.01 33.6,23.81 33.6,24.26 U$4.7
N$3  (via drill 0.33)
  Top 0.203: v79.12,33.15 80.01,34.04 U$2.P$12
  Bottom 0.203: v79.12,33.15 79.12,33.06 78.23,32.17 Q4.3
N$4  (via drill 0.51)
  other vias: 76.2,25.4
N$5
  Top 0.33: F2.1 16.98,16.88 23.11,16.88 D2.A
N$6
  Bottom 0.203: R9.1 72.72,29.77 75.56,29.77 76.72,30.93 78.14,30.93 79.12,29.95 Q4.1
N$7
  Bottom 0.203: Q1.1 7.38,17.77 10.13,17.77 R5.1
N$8
  Bottom 0.203: C25.1 39.92,19.81 39.92,24.17 40.01,24.26 U$4.2
N$9  (via drill 0.33)
  Top 0.203: v3.2,19.81 2.31,18.92 U$3.P$12
  Bottom 0.203: v3.2,19.81 6.31,19.81 Q1.3
N$10
  Top 0.33: U$3.P$5 13.78,28.19 JP3G.1
N$11
  Top 0.33: U$3.P$8 JP4G.1
N$13
  Top 0.33: U$1.VIN 28,11.37 27.74,11.37 D1.C
N$14
  Bottom 0.203: U$4.4 38.14,23.63 C25.2
N$15
  Bottom 0.203: C30.1 32.18,19.81 36.18,23.81 36.18,24.26 U$4.5
N$16
  Bottom 0.203: C30.2 29.96,19.81 32.8,22.66 33.78,22.66 34.85,23.72 34.85,24.26 U$4.6
N$17
  Top 0.203: ANALOG_MUX.6 56.01,18.66 56.01,18.03 54.23,16.26 52.09,16.26 51.21,15.37 51.21,15.01 49.61,13.41 49.34,13.41 C5.2 49.25,13.32 49.25,11.54 R13.2
N$18
  Bottom 0.203: C32.2 41.87,20.08 41.52,20.08 40.45,19.01 39.2,19.01 39.03,19.19 39.03,23.99 38.76,24.26 U$4.3
N$19
  Top 0.203: ANALOG_MUX.8 57.43,18.66 57.43,16.79 58.23,15.99 58.23,14.48 C3.2 57.16,13.32 57.16,11.54 R8.2
N$20
  Top 0.203: ANALOG_MUX.7 56.63,18.66 56.63,16.61 55.3,15.28 55.3,14.66 54.05,13.41 C4.2 R12.2
N$21
  Top 0.33: JP2G.1 69.34,35.05 69.85,34.54 U$2.P$8
N$26  (via drill 0.33)
  Top 0.203: v50.14,17.23 53.96,17.23 54.76,18.03 54.76,18.66 ANALOG_MUX.4 | v43.74,13.94 43.03,13.94 42.49,13.41 C1.2 42.41,13.32 42.41,11.54 R22.2
  Bottom 0.203: v50.14,17.23 49.78,17.23 46.49,13.94 v43.74,13.94
N$28
  Top 0.203: ANALOG_MUX.3 54.05,18.74 54.05,19.37 53.07,20.34 45.7,20.34 38.94,13.59 38.94,13.41 C11.2 38.85,13.32 38.85,11.54 R23.2
N$30  (via drill 0.33)
  Top 0.203: v49.43,19.72 53.07,19.72 53.43,19.37 53.43,18.74 ANALOG_MUX.2 | v37.34,17.15 37.34,15.37 35.38,13.41 C17.2 35.29,13.32 35.29,11.54 R24.2
  Bottom 0.203: v49.43,19.72 46.85,17.15 v37.34,17.15
N$34
  Top 0.203: ANALOG_MUX.22 54.05,26.03 54.05,26.66 53.25,27.46 48.9,27.46 44.54,23.1 42.85,23.1 41.87,24.08 C13.2 41.78,24.08 41.6,23.9 39.83,23.9 R26.2
N$36
  Top 0.203: ANALOG_MUX.21 54.76,26.03 54.76,26.66 53.34,28.08 50.32,28.08 49.16,29.23 49.16,30.3 48.18,31.28 C15.2 48.09,31.37 48.01,31.46 R27.2
N$38
  Top 0.203: ANALOG_MUX.20 55.38,26.03 55.38,26.66 53.61,28.44 50.49,28.44 50.23,28.7 50.23,30.21 51.3,31.28 C14.2 51.3,31.37 51.12,31.55 51.12,33.33 R28.2
N$42
  Top 0.203: ANALOG_MUX.18 56.63,26.03 56.63,28.08 56.1,28.61 56.1,30.3 57.07,31.28 C18.2 57.16,31.37 57.16,33.33 R30.2
N$43
  Top 0.203: ANALOG_MUX.17 57.43,26.03 57.43,26.66 58.14,27.37 63.12,27.37 C19.2 69.43,21.15 71.39,21.15 R31.2
N$46
  Top 0.203: ANALOG_MUX.16 58.05,25.95 58.05,25.32 63.83,19.55 67.83,19.55 69.34,18.03 C20.2 R32.2
N$57
  Top 0.203: LED1.C 89.52,5.14 89.52,7.37 R2.2
N$58
  Top 0.203: LED2.C 83.92,5.14 83.92,7.37 R3.2
N$59
  Top 0.203: LED4.C 16.89,14.74 18.85,14.74 R4.2
N$69
  Top 0.33: F1.1 16.89,11.46 23.11,11.46 D1.A
RI1
  Top 0.203: U$1.TX2 61.52,54.04 61.52,50.13 66.94,44.7 66.94,42.3 CEL1.3
RI2
  Top 0.203: CEL2.3 49.25,42.3 49.25,46.93 56.36,54.04 U$1.TX3
RI3
  Top 0.203: U$1.10 24.71,54.04 24.71,51.37 31.38,44.7 31.38,42.3 CEL3.3
RI4
  Top 0.203: U$1.12 19.56,53.42 17.6,51.46 17.6,46.48 15.29,44.17 13.6,44.17 11.73,42.3 11.11,42.3 CEL4.3
RO1
  Top 0.203: U$1.RX2 64.01,49.68 70.32,43.37 72.63,43.37 73.7,42.3 CEL1.5
RO2
  Top 0.203: CEL2.5 56.01,42.3 56.01,51.19 58.85,54.04 U$1.RX3
RO3
  Bottom 0.203: U$1.9 27.2,54.04 27.2,50.93 34.76,43.37 37.07,43.37 38.14,42.3 CEL3.5
RO4
  Top 0.203: CEL4.5 17.96,42.3 17.96,49.95 22.05,54.04 U$1.11
RX  (via drill 0.33)
  Top 0.33: v43.65,26.12 v39.83,29.95
  Bottom 0.33: v39.83,29.95 38.32,29.95 36.27,31.99 36.27,34.04 U$4.14 | v43.65,26.12 53.43,26.12 59.3,31.99 67.92,31.99 71.65,28.26 80.96,28.26 84.81,24.41 X2.2
RX1
  Bottom 0.203: U$4.13 34.94,34.04 34.94,32.7 38.32,29.32 40.8,29.32 50.23,38.75 50.23,40.26 51.21,41.24 51.65,41.24 52.81,42.39 52.81,42.66 62.41,52.26 67.3,52.26 69.08,54.04 U$1.RX1
SCRN_PWR  (via drill 0.33, 0.6)
  Top 0.33: v29.87,16.88 27.74,16.88 D2.C | v84.33,23.37 84.33,27.81 X2.4
  Top 0.889: X2.4 87.91,29.95 X2.8 X2.7
  Bottom 0.33: v29.87,16.88 40.01,6.74 40.01,4.7 41.43,3.28 66.32,3.28 68.01,4.97 68.01,7.1 72.45,11.54 75.81,11.54 76.96,12.7 78.74,12.7 84.33,18.29 v84.33,23.37
SHDN
  Bottom 0.203: U$4.18 41.25,34.12 41.25,36.26 40.89,36.61 40.89,37.86 46.41,43.37 46.67,43.37 47.83,44.53 47.83,52.44 46.23,54.04 U$1.2
TS1  (via drill 0.33)
  Top 0.203: v58.14,17.15 58.59,16.7 58.59,12.43 61.16,9.86 61.16,9.68 R7.1 | v58.14,24.35 v58.14,23.1 | v66.94,37.06 v58.14,28.26
  Bottom 0.203: v58.14,23.1 v58.14,17.15 | v58.14,28.26 v58.14,24.35 | v66.94,37.06 66.94,39.73 CEL1.6
TS1OUT  (via drill 0.33)
  Top 0.203: v57.43,19.9 57.96,19.37 57.96,18.74 ANALOG_MUX.9 | v59.92,13.77 60.81,13.77 61.16,13.41 C2.2 61.25,13.32 61.25,11.54 R7.2
  Bottom 0.203: v57.43,19.9 54.32,19.9 49.96,15.54 49.96,15.01 51.21,13.77 v59.92,13.77
TS2  (via drill 0.33)
  Top 0.203: v47.03,18.21 47.03,14.57 46.85,14.39 45.16,14.39 44.9,14.12 44.9,10.65 45.96,9.59 45.96,9.41 R21.1 | v44.09,34.66 v44.09,28.7
  Bottom 0.203: v47.03,18.21 47.03,21.86 42.94,25.95 42.94,27.55 v44.09,28.7 | v44.09,34.66 49.16,39.73 CEL2.6
TS2OUT
  Top 0.203: ANALOG_MUX.5 55.38,18.66 55.38,18.03 53.96,16.61 48.81,16.61 47.38,15.19 47.38,14.39 46.41,13.41 46.05,13.41 C9.2 45.96,13.32 45.96,11.28 R21.2
TS3
  Top 0.203: R25.1 37.87,20.88 37.87,22.3 36.89,23.28 36.89,27.46 38.41,28.97 38.41,32.79 31.47,39.73 CEL3.6
TS3OUT
  Top 0.203: ANALOG_MUX.23 53.43,25.95 53.43,25.32 49.87,21.77 42.94,21.77 41.87,20.7 C12.2 41.87,20.79 39.83,20.79 R25.2
TS4  (via drill 0.33)
  Top 0.203: v48.01,37.41 50.49,37.41 52.63,35.28 54.05,35.28 R29.1 | v37.78,31.46 30.05,39.19 v19.91,39.19
  Bottom 0.203: v48.01,37.41 42.05,31.46 v37.78,31.46 | v19.91,39.19 18.22,40.88 12.18,40.88 11.11,39.82 CEL4.6
TS4OUT
  Top 0.203: ANALOG_MUX.19 56.01,26.03 56.01,28.17 55.12,29.06 55.12,30.3 54.14,31.28 C16.2 54.14,31.37 54.14,33.33 R29.2
TS_CON
  Top 0.203: C24.1 76.81,13.14 74.85,13.14 74.23,12.52 73.17,12.52 72.45,13.23 LMT87.OUT 72.36,13.23 66.76,7.63 56.01,7.63 54.23,5.86 53.87,5.86 U$1.A6
TX  (via drill 0.33)
  Top 0.203: v76.71,27.18 78.99,27.18 v81.28,29.46
  Bottom 0.203: U$4.15 37.43,34.12 37.43,34.66 36.63,35.46 34.49,35.46 34.31,35.28 34.31,27.9 36.8,25.41 36.8,17.5 36.72,17.41 36.72,16.88 37.07,16.52 48.54,16.52 55.74,23.72 68.45,23.72 71.91,27.18 v76.71,27.18 | v81.28,29.46 84.18,29.46 X2.3
TX1
  Bottom 0.203: U$4.12 33.69,34.12 33.69,35.19 35.12,36.61 37.78,36.61 43.83,42.66 43.83,51.99 45.16,53.33 45.16,55.28 45.78,55.91 64.72,55.91 66.5,54.13 U$1.TX1
VS1  (via drill 0.33)
  Top 0.203: v54.67,14.92 54.67,14.83 54.23,14.39 52.54,14.39 52.27,14.12 52.27,12.79 49.34,9.86 49.34,9.68 R13.1 | v70.76,37.06 v70.76,25.15
  Bottom 0.203: v54.67,14.92 55.83,14.92 57.43,16.52 59.38,16.52 66.23,23.37 68.99,23.37 v70.76,25.15 | v70.76,37.06 71.39,37.68 71.39,39.64 71.3,39.73 CEL1.7
VS2  (via drill 0.33)
  Top 0.203: v36.27,26.84 34.23,24.79 34.23,10.92 35.29,9.86 35.29,9.68 R24.1
  Bottom 0.203: v36.27,26.84 40.54,26.84 53.43,39.73 CEL2.7
VS3
  Top 0.203: R28.1 51.03,35.28 49.61,35.28 48.09,36.79 45.16,36.79 38.58,43.37 35.74,43.37 34.58,42.22 34.58,41.95 33.52,40.88 33.07,40.88 32.45,40.26 32.45,39.37 33.07,38.75 34.67,38.75 35.65,39.73 CEL3.7
VS4  (via drill 0.33)
  Top 0.203: v81.28,13.33 76.83,17.78 73.66,17.78 R32.1 | v75.56,2.54 10.79,2.54 6.99,6.35 6.99,17.15 1.27,22.86 1.27,27.94 12.06,38.73 14.61,38.73 15.24,39.37 CEL4.7
  Bottom 0.203: v81.28,13.33 75.56,7.62 v75.56,2.54

### Text on the board
tPlace: SmartTree BMS / Version 6.0 | 3V3 | 5V | L2 | L1